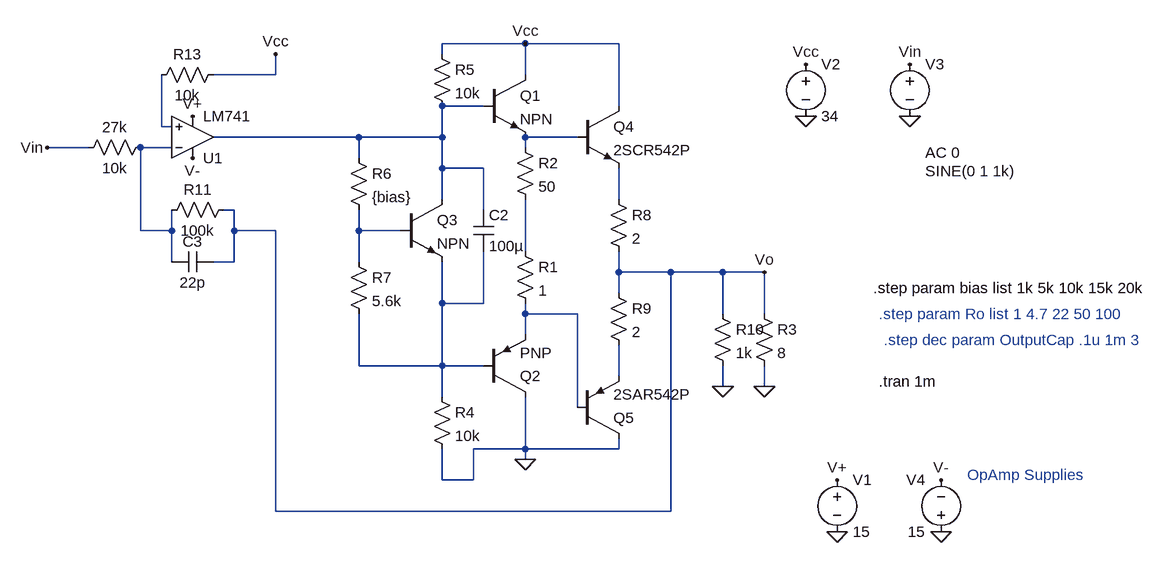
[diagram p0: schematic CompSym_OutputStage_darlington_withSerco.asc]
CompSym_OutputStage_darlington_withSerco.asc, the LTspice schematic file:
Version 4
SHEET 1 1480 720
WIRE 224 -80 96 -80
WIRE 368 -80 224 -80
WIRE 96 -64 96 -80
WIRE -160 -32 -160 -64
WIRE -160 -32 -256 -32
WIRE 224 -32 224 -80
WIRE 160 16 96 16
WIRE 368 16 368 -80
WIRE -336 48 -336 -32
WIRE -320 48 -336 48
WIRE -32 64 -256 64
WIRE 96 64 96 16
WIRE 96 64 -32 64
WIRE 304 64 224 64
WIRE -448 80 -512 80
WIRE -320 80 -368 80
WIRE 224 80 224 64
WIRE -32 96 -32 64
WIRE 96 112 96 64
WIRE 160 112 96 112
WIRE 96 160 96 112
WIRE 368 160 368 112
WIRE -224 176 -240 176
WIRE 160 176 160 112
WIRE -368 208 -368 80
WIRE -320 208 -320 176
WIRE -320 208 -368 208
WIRE -224 208 -224 176
WIRE -160 208 -224 208
WIRE -32 208 -32 176
WIRE 32 208 -32 208
WIRE 224 240 224 160
WIRE -320 256 -320 208
WIRE -224 256 -224 208
WIRE -224 256 -256 256
WIRE -32 256 -32 208
WIRE 368 272 368 240
WIRE 448 272 368 272
WIRE 528 272 448 272
WIRE 592 272 528 272
WIRE 368 304 368 272
WIRE 96 320 96 256
WIRE 160 320 160 240
WIRE 160 320 96 320
WIRE 224 336 224 320
WIRE 304 336 224 336
WIRE 528 336 528 272
WIRE 592 336 592 272
WIRE 224 368 224 336
WIRE -32 416 -32 336
WIRE 96 416 96 320
WIRE 96 416 -32 416
WIRE 160 416 96 416
WIRE 368 432 368 384
WIRE 528 448 528 416
WIRE 592 448 592 416
WIRE 96 464 96 416
WIRE 304 480 304 336
WIRE 224 544 224 464
WIRE 224 544 144 544
WIRE 368 544 368 528
WIRE 368 544 224 544
WIRE 224 560 224 544
WIRE 96 592 96 544
WIRE 144 592 144 544
WIRE 144 592 96 592
WIRE -160 640 -160 208
WIRE 448 640 448 272
WIRE 448 640 -160 640
FLAG 592 448 0
FLAG 224 -80 Vcc
FLAG 656 -48 Vcc
FLAG 656 32 0
FLAG 816 32 0
FLAG 816 -48 Vin
FLAG 592 272 Vo
FLAG 224 560 0
FLAG 864 672 0
FLAG 704 672 0
FLAG 704 592 V+
FLAG 864 592 V-
FLAG 528 448 0
FLAG -288 32 V+
FLAG -288 96 V-
FLAG -512 80 Vin
FLAG -160 -64 Vcc
SYMBOL res 208 224 R0
SYMATTR InstName R1
SYMATTR Value 1
SYMBOL res 208 64 R0
SYMATTR InstName R2
SYMATTR Value 50
SYMBOL res 576 320 R0
SYMATTR InstName R3
SYMATTR Value 8
SYMBOL voltage 656 -64 R0
WINDOW 123 0 0 Left 2
WINDOW 39 0 0 Left 2
SYMATTR InstName V2
SYMATTR Value 34
SYMBOL voltage 816 -64 R0
WINDOW 3 24 180 Left 2
WINDOW 123 24 152 Left 2
WINDOW 39 24 124 Left 2
SYMATTR Value SINE(0 1 1k)
SYMATTR Value2 AC 0
SYMATTR InstName V3
SYMBOL npn 32 160 R0
SYMATTR InstName Q3
SYMBOL res -48 80 R0
SYMATTR InstName R6
SYMATTR Value {bias}
SYMBOL res -48 240 R0
SYMATTR InstName R7
SYMATTR Value 5.6k
SYMBOL res 80 448 R0
SYMATTR InstName R4
SYMATTR Value 10k
SYMBOL res 80 -80 R0
SYMATTR InstName R5
SYMATTR Value 10k
SYMBOL cap 144 176 R0
SYMATTR InstName C2
SYMATTR Value 100µ
SYMBOL npn 160 -32 R0
SYMATTR InstName Q1
SYMBOL pnp 160 464 M180
SYMATTR InstName Q2
SYMBOL voltage 704 576 R0
WINDOW 123 0 0 Left 2
WINDOW 39 0 0 Left 2
SYMATTR InstName V1
SYMATTR Value 15
SYMBOL voltage 864 688 R180
WINDOW 0 24 96 Left 2
WINDOW 3 24 16 Left 2
WINDOW 123 0 0 Left 2
WINDOW 39 0 0 Left 2
SYMATTR InstName V4
SYMATTR Value 15
SYMBOL npn 304 16 R0
SYMATTR InstName Q4
SYMATTR Value 2SCR542P
SYMBOL pnp 304 528 M180
SYMATTR InstName Q5
SYMATTR Value 2SAR542P
SYMBOL res 352 144 R0
SYMATTR InstName R8
SYMATTR Value 2
SYMBOL res 352 288 R0
SYMATTR InstName R9
SYMATTR Value 2
SYMBOL res 512 320 R0
SYMATTR InstName R10
SYMATTR Value 1k
SYMBOL Opamps\\LM741 -288 128 M180
SYMATTR InstName U1
SYMBOL res -336 192 R270
WINDOW 0 32 56 VTop 2
WINDOW 3 0 56 VBottom 2
SYMATTR InstName R11
SYMATTR Value 100k
SYMBOL cap -320 272 R270
WINDOW 0 32 32 VTop 2
WINDOW 3 0 32 VBottom 2
SYMATTR InstName C3
SYMATTR Value 22p
SYMBOL res -464 96 R270
WINDOW 0 32 56 VTop 2
WINDOW 3 0 56 VBottom 2
SYMATTR InstName 27k
SYMATTR Value 10k
SYMBOL res -352 -16 R270
WINDOW 0 32 56 VTop 2
WINDOW 3 0 56 VBottom 2
SYMATTR InstName R13
SYMATTR Value 10k
TEXT 768 440 Left 2 !.tran 1m
TEXT 760 296 Left 2 !.step param bias list 1k 5k 10k 15k 20k
TEXT 768 336 Left 2 ;.step param Ro list 1 4.7 22 50 100
TEXT 776 376 Left 2 ;.step dec param OutputCap .1u 1m 3
TEXT 904 584 Left 2 ;OpAmp Supplies

The netlist it stands for:
* CompSym_OutputStage_darlington_withSerco.asc
R1 N007 N009 1
R2 N003 N007 50
R3 Vo 0 8
V2 Vcc 0 34
V3 Vin 0 SINE(0 1 1k) AC 0
Q3 N001 N006 N008 0 NPN
R6 N001 N006 {bias}
R7 N006 N008 5.6k
R4 N008 0 10k
R5 Vcc N001 10k
C2 N001 N008 100µ
Q1 Vcc N001 N003 0 NPN
Q2 0 N008 N009 0 PNP
V1 V+ 0 15
V4 0 V- 15
Q4 Vcc N003 N005 0 2SCR542P
Q5 0 N009 N010 0 2SAR542P
R8 N005 Vo 2
R9 Vo N010 2
R10 Vo 0 1k
XU1 N002 N004 V- V+ N001 LM741  ; pins In+ In- V+ V- OUT
R11 N004 Vo 100k
C3 N004 Vo 22p
R§27k Vin N004 10k
R13 N002 Vcc 10k
.model NPN NPN
.model PNP PNP
.lib standard.bjt
.tran 1m
.step param bias list 1k 5k 10k 15k 20k
* .step param Ro list 1 4.7 22 50 100
* .step dec param OutputCap .1u 1m 3
* OpAmp Supplies
.lib LM741.lib
.backanno
.end